# EAGLE design debug-board (EAGLE 9.3.0)
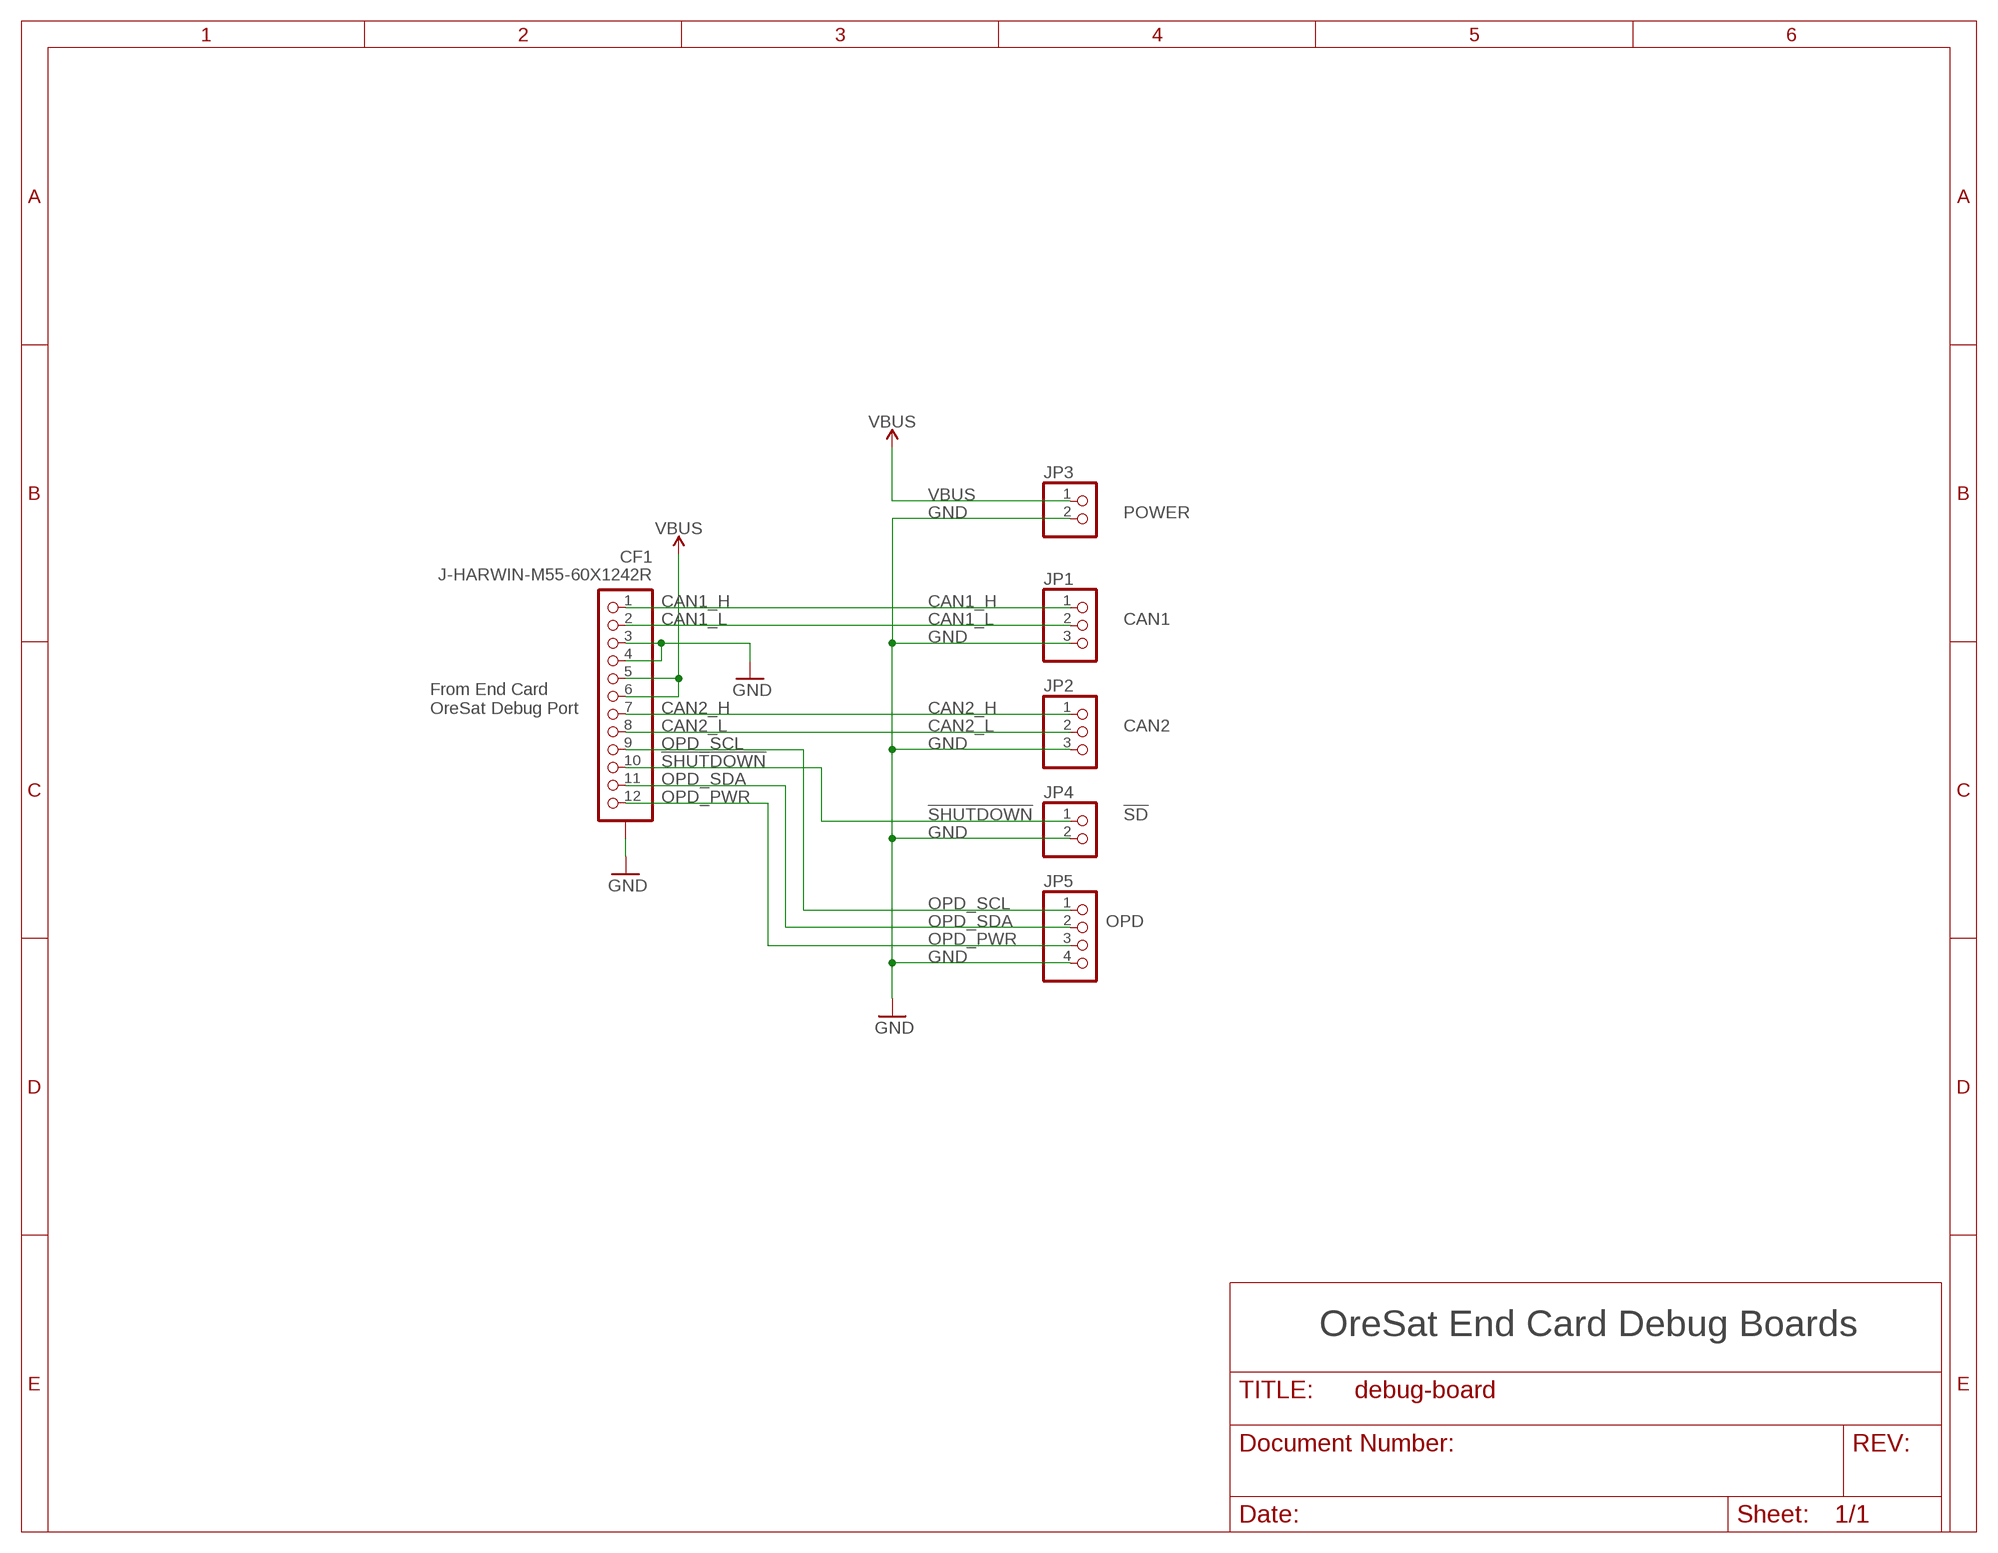
[diagram p0: schematic, sheet 1]

## Parts
CF1  J-HARWIN-M55-60X1242R  [HARWIN-M55-60X1242R]
JP1  PINHD-1X3  [1X03]
JP2  PINHD-1X3  [1X03]
JP3  PINHD-1X2  [1X02]
JP4  PINHD-1X2  [1X02]
JP5  PINHD-1X4  [1X04]

## Nets
!SHUTDOWN: CF1.10 JP4.1
CAN1_H: CF1.1 JP1.1
CAN1_L: CF1.2 JP1.2
CAN2_H: CF1.7 JP2.1
CAN2_L: CF1.8 JP2.2
GND: CF1.3 CF1.4 CF1.P$1(SHIELDS) CF1.P$2(SHIELDS) CF1.P$3(SHIELDS) CF1.P$4(SHIELDS) JP1.3 JP2.3 JP3.2 JP4.2 JP5.4
OPD_PWR: CF1.12 JP5.3
OPD_SCL: CF1.9 JP5.1
OPD_SDA: CF1.11 JP5.2
VBUS: CF1.5 CF1.6 JP3.1

## Notes on the sheet
- POWER
- CAN1
- From End Card 
  OreSat Debug Port
- CAN2
- !SD
- OPD
- OreSat End Card Debug Boards

## Library data of the parts
CF1 = J-Harwin-M55-60X1242R-12pin-1.27mm-F-vertical:J-HARWIN-M55-60X1242R
JP1 JP2 = pinhead:PINHD-1X3: PIN HEADER
JP3 JP4 = pinhead:PINHD-1X2: PIN HEADER
JP5 = pinhead:PINHD-1X4: PIN HEADER

## Board
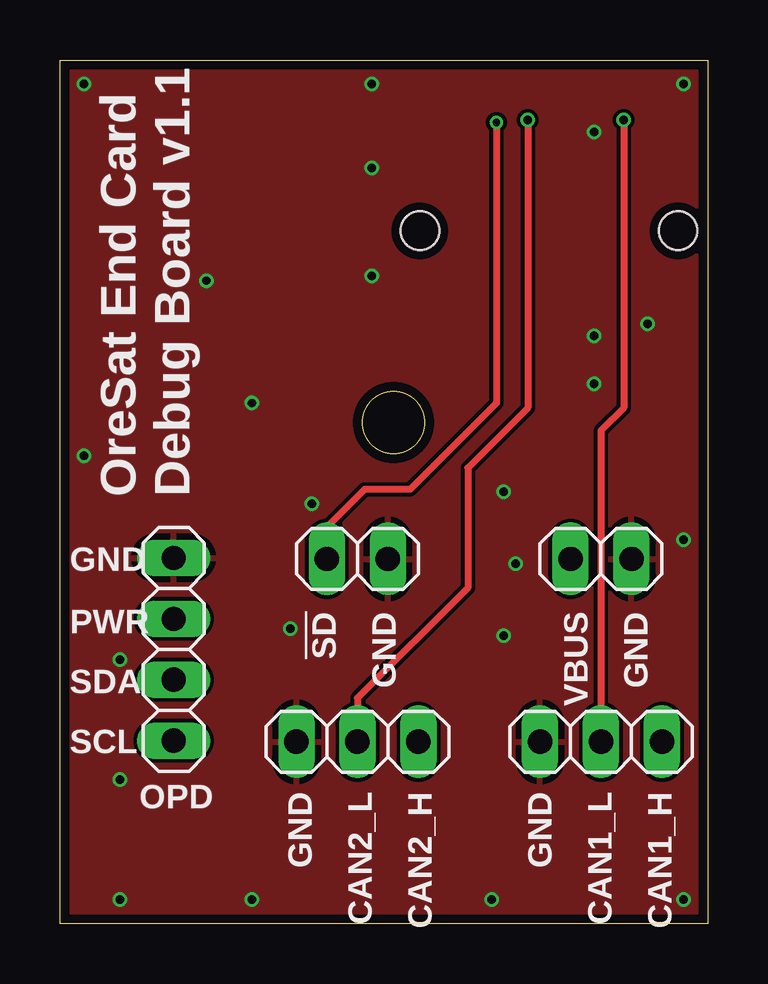
[diagram p1: board, top side]
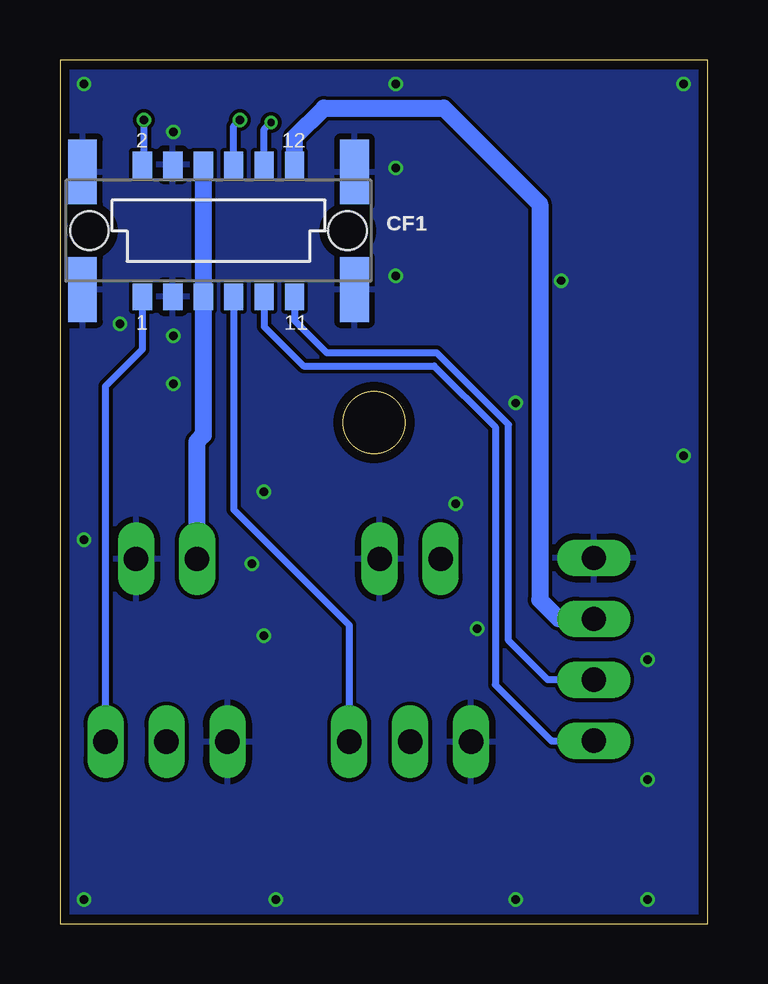
[diagram p2: board, bottom side, seen from below]

Size 27 x 36 mm. Coordinates in mm from the lower left corner, seen from the top.
Outline: 27,0 0,0 0,36 27,36 27,0
Outline: circle at 13.91,20.89 radius 1.3
Copper layers (1*16): Top 0.035559375mm / dielectric 1.6mm / Bottom 0.035559375mm
Design rules "oshpark-2layer-tented": minimum track width 6mil, minimum drill 10mil, track to track 6mil, track to pad 6mil, pad to pad 6mil, via to via 6mil, smd to smd 6mil, copper to edge 15mil, drill to drill 6mil, minimum pad ring 5mil, minimum via ring 5mil, stop-mask expansion 2.5mil, vias tented up to drill 20mil, thermal gap 10mil

### Footprints (pad centres in the part's own frame; a part is rotated, then mirrored left to right if it is on the bottom)
HARWIN-M55-60X1242R = smd 0.8 x 1.1: 1 -3.175,-2.75; 2 -3.175,2.75; 3 -1.905,-2.75; 4 -1.905,2.75; 5 -0.635,-2.75; 6 -0.635,2.75; 7 0.635,-2.75; 8 0.635,2.75; 9 1.905,-2.75; 10 1.905,2.75; 11 3.175,-2.75; 12 3.175,2.75 | smd 1.2 x 2.7: P$1 -5.67,-2.45; P$2 -5.67,2.45; P$3 5.67,2.45; P$4 5.67,-2.45 | hole 1.6: -5.385,0; 5.385,0
1X03 = drill 1.016 long: 1 -2.54,0; 2 0,0; 3 2.54,0
1X02 = drill 1.016 long: 1 -1.27,0; 2 1.27,0
1X04 = drill 1.016 long: 1 -3.81,0; 2 -1.27,0; 3 1.27,0; 4 3.81,0

### Placement (x,y rotation side)
CF1  20.39,28.88 0 bottom
JP1  22.56,7.58 180 top
JP2  12.4,7.58 180 top
JP3  22.56,15.2 0 top
JP4  12.4,15.2 0 top
JP5  4.74,11.43 90 top

### Tracks (layer width: path | path; a pad name or v marks a point on that pad's centre or on a via)
!SHUTDOWN  (via drill 0.3)
  Top 0.3: v18.2,33.4 18.2,21.7 14.6,18.1 12.7,18.1 11.13,16.53 JP4.1
  Bottom 0.3: CF1.10 18.48,33.12 v18.2,33.4
CAN1_H
  Bottom 0.3: JP1.1 25.1,22.4 23.57,23.93 CF1.1
CAN1_L  (via drill 0.35)
  Top 0.3: v23.5,33.5 23.5,21.5 22.56,20.56 JP1.2
  Bottom 0.3: CF1.2 23.5,31.7 v23.5,33.5
CAN2_H
  Bottom 0.3: JP2.1 14.94,12.44 19.75,17.25 CF1.7
CAN2_L  (via drill 0.35)
  Top 0.3: v19.5,33.5 19.5,21.5 17,19 17,14 12.4,9.4 JP2.2
  Bottom 0.3: CF1.8 19.75,33.24 v19.5,33.5
GND  (via drill 0.35)
  other vias: 26,35 1,35 26,1 26,16 13,35 1,19.5 8,1 8,21.7 10.5,17.5 22.27,22.5 24.5,25 22.27,33 22.27,24.5 13,31.5 13,27 18.5,12 19,15 2.5,1 9.6,12.3 18.5,18 18,1 2.5,6 2.5,11 6.1,26.8
  pour Bottom: 0,0 27,0 27,36 0,36
  pour Top: 0,0 27,0 27,36 0,36
OPD_PWR
  Bottom 0.7: CF1.12 17.21,32.78 16,34 11,34 7,30 7,13.5 6.2,12.7 JP5.3
OPD_SCL
  Bottom 0.3: CF1.9 18.48,24.89 16.85,23.25 11.4,23.25 8.85,20.7 8.85,9.95 6.5,7.6 6.48,7.62 JP5.1
OPD_SDA
  Bottom 0.3: CF1.11 17.21,25.13 15.88,23.8 11.3,23.8 8.3,20.8 8.3,11.8 6.66,10.16 JP5.2
VBUS
  Bottom 0.7: JP3.1 21.29,20.09 21.02,20.36 CF1.5 CF1.6

### Text on the board
tPlace: OreSat End Card / Debug Board v1.1 | GND | !SD | GND | VBUS | GND | PWR | SDA | SCL | GND | CAN2_L | CAN2_H | GND | CAN1_L | CAN1_H | OPD